# Altium schematic sheet QLA-Test.SchDoc
size A
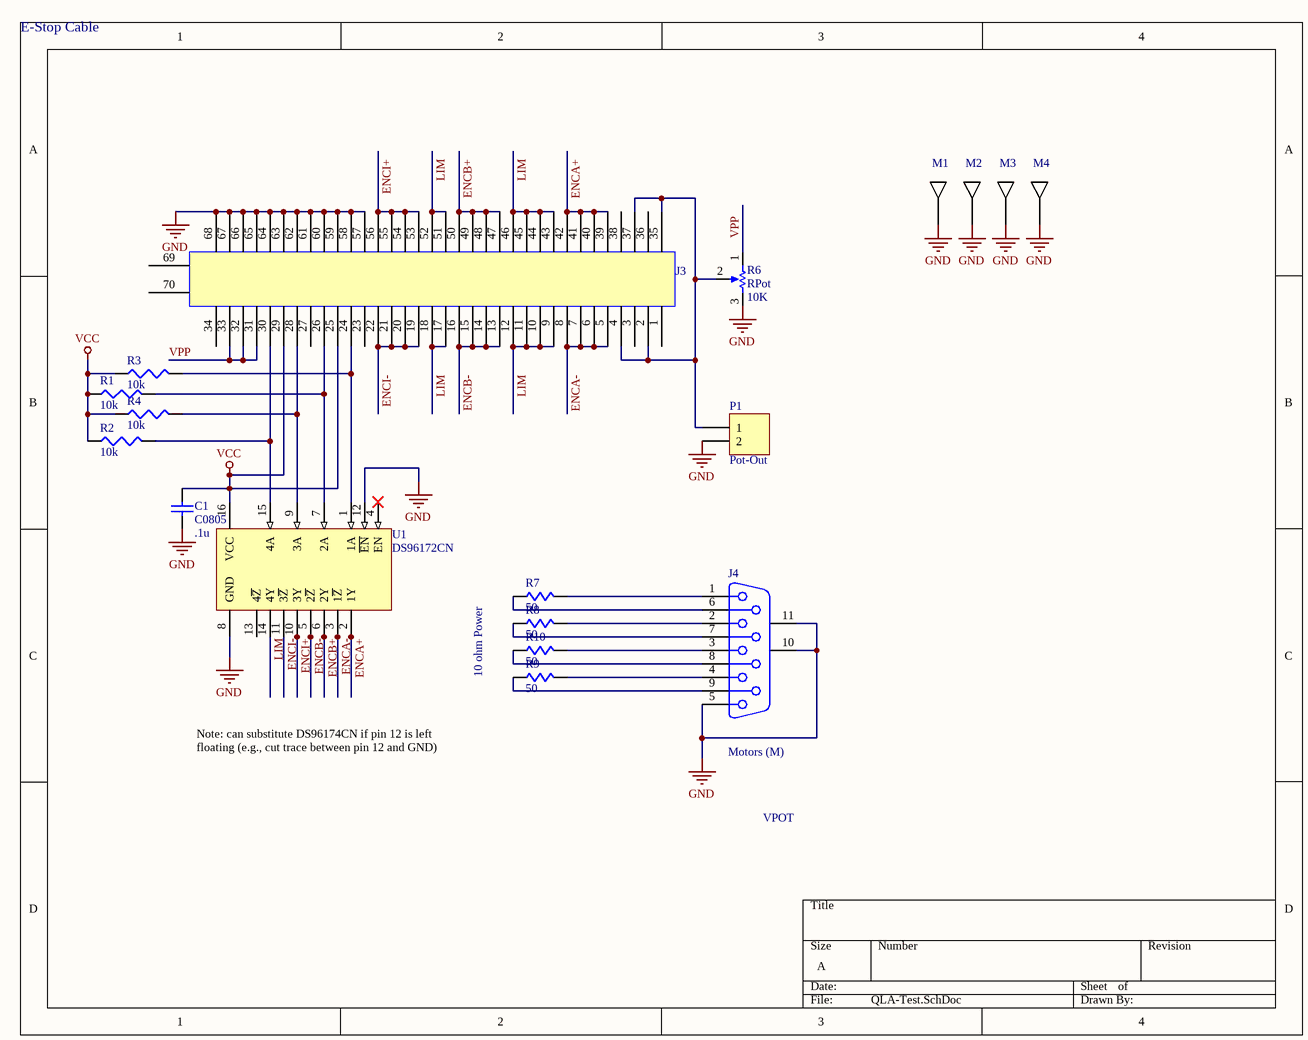
[diagram p0: QLA-Test.SchDoc]

## Parts
C1  C0805  value .1u  [0805]
J3  HPDB68  [HPDB68FV]  (value not drawn)
J4  Sensor (M)  [DB9M]  (value not drawn)
M1  MHOLE  [MHOLE4]  (value not drawn)  (no BOM)
M2  MHOLE  [MHOLE4]  (value not drawn)  (no BOM)
M3  MHOLE  [MHOLE4]  (value not drawn)  (no BOM)
M4  MHOLE  [MHOLE4]  (value not drawn)  (no BOM)
P1  Pot-Out  [HDR1X2]
R1  10k  [R0805]
R2  10k  [R0805]
R3  10k  [R0805]
R4  10k  [R0805]
R6  RPot  value 10K  [VR5]
R7  50  [TO-220AC]
R8  50  [TO-220AC]
R9  50  [TO-220AC]
R10  50  [TO-220AC]
U1  DS96172CN  [N16E]

## Nets
GND: C1.1 J3.57 J3.58 J3.59 J3.60 J3.61 J3.62 J3.63 J3.64 J3.65 J3.66 J3.67 J3.68 J4.5 J4.10(MH1) J4.11(MH2) M1.1 M2.1 M3.1 M4.1 P1.2 R6.3(BOT) U1.8(GND) U1.12(~{EN})
VCC: C1.2 J3.25 J3.29 R1.1 R2.1 R3.1 R4.1 U1.16(VCC)
ENCA+: J3.39 J3.40 J3.41 J3.42 U1.2(1Y)
ENCA-: J3.5 J3.6 J3.7 J3.8 U1.3(1~{Z})
ENCB+: J3.47 J3.48 J3.49 J3.50 U1.6(2Y)
ENCB-: J3.13 J3.14 J3.15 J3.16 U1.5(2~{Z})
ENCI+: J3.53 J3.54 J3.55 J3.56 U1.10(3Y)
ENCI-: J3.19 J3.20 J3.21 J3.22 U1.11(3~{Z})
LIM: J3.9 J3.10 J3.11 J3.12 J3.17 J3.18 J3.43 J3.44 J3.45 J3.46 J3.51 J3.52 U1.14(4Y)
VPP: J3.31 J3.32 J3.33 R6.1(TOP)
NetJ3_2: J3.2 J3.4 J3.35 J3.37 P1.1 R6.2(TAP)
NetJ3_24: J3.24 R3.2 U1.1(1A)
NetJ3_26: J3.26 R1.2 U1.7(2A)
NetJ3_28: J3.28 R4.2 U1.9(3A)
NetJ3_30: J3.30 R2.2 U1.15(4A)
NetJ4_1: J4.1 R7.2
NetJ4_2: J4.2 R8.2
NetJ4_3: J4.3 R10.2
NetJ4_4: J4.4 R9.2
NetJ4_6: J4.6 R7.1
NetJ4_7: J4.7 R8.1
NetJ4_8: J4.8 R10.1
NetJ4_9: J4.9 R9.1

Not connected (* = marked no-connect by the designer): J3 1 3 23 27 34 36 38 69 70; U1 4(EN)* 13(4~{Z})

## Notes on the sheet
- E-Stop Cable
- 10 ohm Power
- Note: can substitute DS96174CN if pin 12 is left floating (e.g., cut trace between pin 12 and GND)
- VPOT

## Library data of the parts
C1 = C0805: Ceramic Chip Capacitor - Standard; Note: Footprint corresponds to dimensions for bulk cassette packaging. This case size has tightened tolerances.; Published: 17-Jul-2002; LatestRevisionDate: 19-Mar-2004; LatestRevisionNote: Silkscreen size reduced.; DatasheetDocument: Mar-2001; PackageDocument: Mar-2001; PackageReference: 0805; Publisher: Altium Limited; Code_JEITA: 0805; Code_IPC: 2012[0805]; ComponentLink1Description: Manufacturer Link; ComponentLink1URL: http://www.kemet.com/; ComponentLink2Description: Datasheet; ComponentLink2URL: http://www.kemet.com/kemet/web/homepage/kechome.nsf/vapubfilesname/F3102TA.pdf/$file/F3102TA.pdf
J3 = HPDB68: Half Pitch D-Sub 68Pin
J4 = D Connector 9_1: Receptacle Assembly, 9 Position, Right Angle; Manufacturer: Generic Components; Package Information: Latest Revision: O; Positions: 9; Published: 15-Jun-2001; Revision: July-2002: Re-released for DXP Platform.; Datasheet: (1-Sep-1999); Package Reference: 788750; Publisher: Altium Limited; Class I: Connector; Orientation: Right Angle; Gender: Receptacle
M1-M4 = MHOLE: Mounting Hole
P1 = Header 2: Header, 2-Pin; LatestRevisionDate: 17-Jul-2002; LatestRevisionNote: Re-released for DXP Platform.; Publisher: Altium Limited
R1-R4 = R
R6 = RPot: Potentiometer; Sim Note: Enter the Resistance value and the set point into parameter fields.; Set Position: 0.5; Published: 8-Jun-2000; LatestRevisionDate: 17-Jul-2002; LatestRevisionNote: Re-released for DXP Platform.; PackageReference: VR5; Publisher: Altium Limited; PackageDescription: Variable Resistor, Thru-Hole; 3 Leads
R7-R10 = R: pin to pad: 2>3
U1 = DS96174CN: RS-485/RS-422 Quad Differential Line Driver, 16-pin MDIP; Manufacturer: National Semiconductor; PackageTopMarking: NSUZXYYTTE#*DS96174CN; PowerWise: N; CompType: Interface IC; Published: 4-Dec-2008; DatasheetVersion: Jun-1998; PackageVersion: revG, May-2006; PackageReference: N16E; Publisher: Altium Limited; PackageDescription: MDIP, .750 x .250 x .130in, 16 Lead, .100in Pitch; Supplier 1: Farnell; Supplier Part Number 1: 9493905; PartNumber: DS96174CN; RoHS: N; PinCount: 16; Code_JEDEC: MS-001-BB; ComponentLink1Description: DS96174 Datasheet; ComponentLink1URL: http://www.national.com/ds/DS/DS96174.pdf; ComponentLink2Description: DS96174 Web Page; ComponentLink2URL: http://www.national.com/pf/DS/DS96174.html; ComponentLink3Description: N16E Package Page; ComponentLink3URL: http://www.national.com/packaging/folders/n16e.html